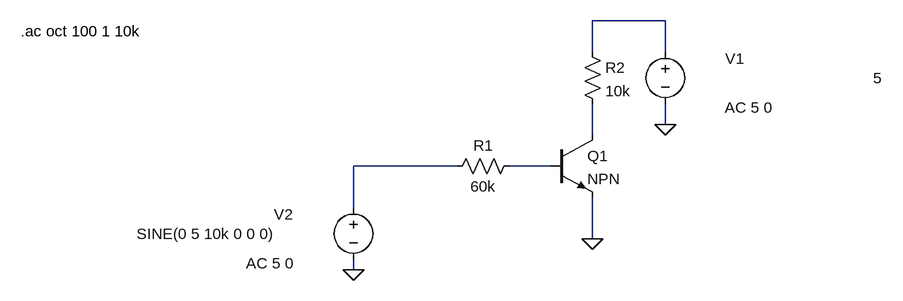
[diagram p0: schematic RC.asc]
RC.asc, the LTspice schematic file:
Version 4
SHEET 1 1088 680
WIRE 752 -112 640 -112
WIRE 640 -64 640 -112
WIRE 752 -64 752 -112
WIRE 752 48 752 16
WIRE 640 64 640 16
WIRE 432 112 272 112
WIRE 576 112 512 112
WIRE 272 176 272 112
WIRE 640 224 640 160
WIRE 272 272 272 256
FLAG 272 272 0
FLAG 640 224 0
FLAG 752 48 0
SYMBOL voltage 272 160 R0
WINDOW 123 -165 102 Left 2
WINDOW 39 0 0 Left 2
WINDOW 0 -122 26 Left 2
WINDOW 3 -334 56 Left 2
SYMATTR Value2 AC 5 0
SYMATTR InstName V2
SYMATTR Value SINE(0 5 10k 0 0 0)
SYMBOL npn 576 64 R0
SYMATTR InstName Q1
SYMBOL res 528 96 R90
WINDOW 0 0 56 VBottom 2
WINDOW 3 32 56 VTop 2
SYMATTR InstName R1
SYMATTR Value 60k
SYMBOL res 624 -80 R0
SYMATTR InstName R2
SYMATTR Value 10k
SYMBOL voltage 752 -80 M0
WINDOW 123 -165 102 Left 2
WINDOW 39 0 0 Left 2
WINDOW 0 -122 26 Left 2
WINDOW 3 -334 56 Left 2
SYMATTR Value2 AC 5 0
SYMATTR InstName V1
SYMATTR Value 5
TEXT -240 -96 Left 2 !.ac oct 100 1 10k

The netlist it stands for:
* RC.asc
V2 N003 0 SINE(0 5 10k 0 0 0) AC 5 0
Q1 N002 N004 0 0 NPN
R1 N004 N003 60k
R2 N001 N002 10k
V1 N001 0 5 AC 5 0
.model NPN NPN
.model PNP PNP
.lib standard.bjt
.ac oct 100 1 10k
.backanno
.end